# EAGLE design pm2013 (EAGLE 6.0)
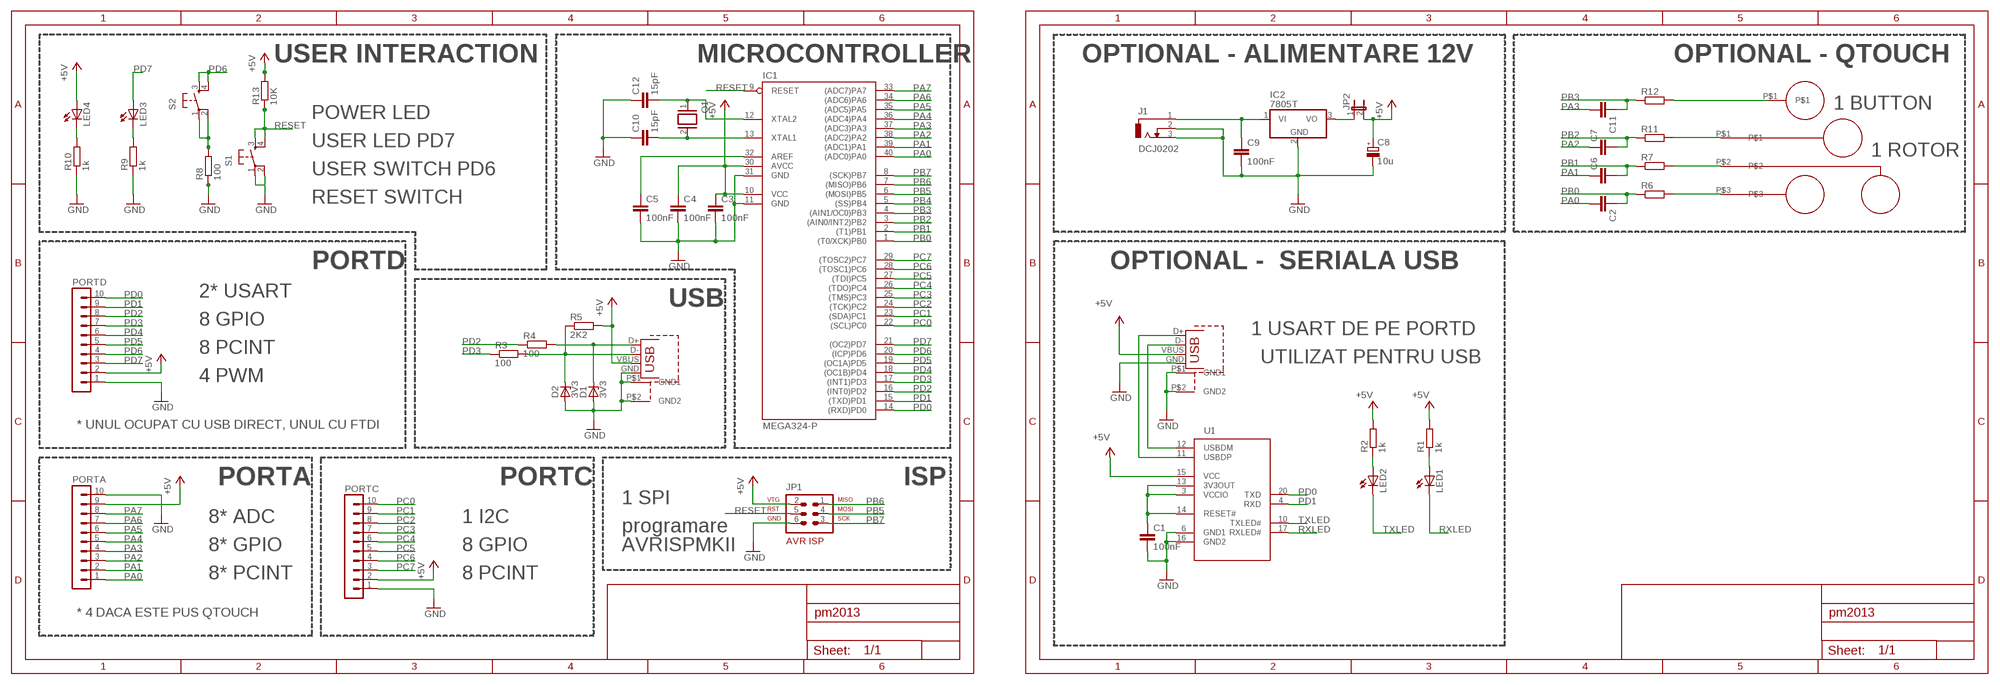
[diagram p0: schematic, sheet 1]

## Parts
C1  100nF  C-EU025-025X050  [C025-025X050]
C2  C-EUC1206  [C1206]
C3  100nF  C-EU025-025X050  [C025-025X050]
C4  100nF  C-EU025-025X050  [C025-025X050]
C5  100nF  C-EU025-025X050  [C025-025X050]
C6  C-EUC1206  [C1206]
C7  C-EUC1206  [C1206]
C8  10u  CPOL-EUE2.5-5  [E2,5-5]
C9  100nF  C-EU025-025X050  [C025-025X050]
C10  15pF  C-EU025-025X050  [C025-025X050]
C11  C-EUC1206  [C1206]
C12  15pF  C-EU025-025X050  [C025-025X050]
D1  3V3  ZENER-DIODEDO34-7  [DO34Z7]
D2  3V3  ZENER-DIODEDO34-7  [DO34Z7]
IC1  MEGA324-P  MEGA16-P  [DIL40]
IC2  7805T  [TO220H]
J1  DCJ0202  [DCJ0202]
JP1  AVR-ISP-6  [AVR-ISP-6]
JP2  JP1E  [JP1]
LED1  TLLR4400  [LED3MM]
LED2  TLLR4400  [LED3MM]
LED3  TLLR4400  [LED3MM]
LED4  TLLR4400  [LED3MM]
PORTA  MA10-1W  [MA10-1W]
PORTC  MA10-1W  [MA10-1W]
PORTD  MA10-1W  [MA10-1W]
Q1  XTAL/S  [QS]
R1  1k  R-EU_0204/7  [0204/7]
R2  1k  R-EU_0204/7  [0204/7]
R3  100  R-EU_0204/7  [0204/7]
R4  100  R-EU_0204/7  [0204/7]
R5  2K2  R-EU_0204/7  [0204/7]
R6  R-EU_M1206  [M1206]
R7  R-EU_M1206  [M1206]
R8  100  R-EU_0204/7  [0204/7]
R9  1k  R-EU_0204/7  [0204/7]
R10  1k  R-EU_0204/7  [0204/7]
R11  R-EU_M1206  [M1206]
R12  R-EU_M1206  [M1206]
R13  10K  R-EU_0204/7  [0204/7]
S1  TAC_SWITCHPTH  [TACTILE-PTH]
S2  TAC_SWITCHPTH  [TACTILE-PTH]
U1  FT231XS  [SSOP20]
U$1  ROTOR_ELECTRODE_TOUCH  [ROTOR_ELECTRODE_TOUCH]
U$2  SIMPLE_ELECTRODE_TOUCH  [SIMPLE_ELECTRODE_TOUCH]
X1  USB  [USB-B-PTH]
X2  USBPTH  USB  [USB-B-PTH]

## Nets
+5V: C3.1 C4.1 C8.+ IC1.10(VCC) IC1.30(AVCC) JP1.2 JP2.2 LED4.A PORTA.9 PORTC.2 PORTD.2 R1.2 R2.2 R5.2 R13.2 U1.15(VCC) X1.VBUS X2.VBUS
GND: C1.2 C3.2 C4.2 C5.2 C8.- C9.2 C10.1 C12.1 D1.A D2.A IC1.11(GND) IC1.31(GND) IC2.2(GND) J1.2 J1.3 JP1.6 PORTA.10 PORTC.1 PORTD.1 R8.1 R9.1 R10.1 S1.1 S1.2 U1.6(GND1) U1.16(GND2) X1.GND X1.P$1(GND1) X1.P$2(GND2) X2.GND X2.P$1(GND1) X2.P$2(GND2)
N$1: LED2.A R2.1
N$2: LED1.A R1.1
N$3: R11.2 U$1.P$1
N$4: R7.2 U$1.P$2
N$5: C1.1 U1.3(VCCIO) U1.13(3V3OUT) U1.14(RESET#)
N$7: R6.2 U$1.P$3
N$14: D1.C R4.2 X2.D+
N$15: D2.C R3.2 R5.1 X2.D-
N$16: C9.1 IC2.1(VI) J1.1
N$17: R8.2 S2.1 S2.2
N$18: IC2.3(VO) JP2.1
N$19: R12.2 U$2.P$1
N$20: C5.1 IC1.32(AREF)
N$21: C10.2 IC1.13(XTAL1) Q1.2
N$22: C12.2 IC1.12(XTAL2) Q1.1
N$24: LED3.K(C) R9.2
N$25: LED4.K(C) R10.2
PA0: C2.2 IC1.40((ADC0)PA0) PORTA.1
PA1: C6.1 IC1.39((ADC1)PA1) PORTA.2
PA2: C7.1 IC1.38((ADC2)PA2) PORTA.3
PA3: C11.2 IC1.37((ADC3)PA3) PORTA.4
PA4: IC1.36((ADC4)PA4) PORTA.5
PA5: IC1.35((ADC5)PA5) PORTA.6
PA6: IC1.34((ADC6)PA6) PORTA.7
PA7: IC1.33((ADC7)PA7) PORTA.8
PB0: C2.1 IC1.1((T0/XCK)PB0) R6.1
PB1: C6.2 IC1.2((T1)PB1) R7.1
PB2: C7.2 IC1.3((AIN0/INT2)PB2) R11.1
PB3: C11.1 IC1.4((AIN1/OC0)PB3) R12.1
PB4: IC1.5((SS)PB4)
PB5: IC1.6((MOSI)PB5) JP1.4
PB6: IC1.7((MISO)PB6) JP1.1
PB7: IC1.8((SCK)PB7) JP1.3
PC0: IC1.22((SCL)PC0) PORTC.10
PC1: IC1.23((SDA)PC1) PORTC.9
PC2: IC1.24((TCK)PC2) PORTC.8
PC3: IC1.25((TMS)PC3) PORTC.7
PC4: IC1.26((TDO)PC4) PORTC.6
PC5: IC1.27((TDI)PC5) PORTC.5
PC6: IC1.28((TOSC1)PC6) PORTC.4
PC7: IC1.29((TOSC2)PC7) PORTC.3
PD0: IC1.14((RXD)PD0) PORTD.10 U1.20(TXD)
PD1: IC1.15((TXD)PD1) PORTD.9 U1.4(RXD)
PD2: IC1.16((INT0)PD2) PORTD.8 R4.1
PD3: IC1.17((INT1)PD3) PORTD.7 R3.1
PD4: IC1.18((OC1B)PD4) PORTD.6
PD5: IC1.19((OC1A)PD5) PORTD.5
PD6: IC1.20((ICP)PD6) PORTD.4 S2.3 S2.4
PD7: IC1.21((OC2)PD7) LED3.A PORTD.3
RESET: IC1.9(RESET) JP1.5 R13.1 S1.3 S1.4
RXLED: LED1.K(C) U1.17(RXLED#)
TXLED: LED2.K(C) U1.10(TXLED#)
USB_D+: U1.11(USBDP) X1.D+
USB_D-: U1.12(USBDM) X1.D-

## Notes on the sheet
- USER INTERACTION | MICROCONTROLLER | OPTIONAL - ALIMENTARE 12V | OPTIONAL - QTOUCH
- 1 BUTTON
- POWER LED
- USER LED PD7
- 1 ROTOR
- USER SWITCH PD6
- RESET SWITCH
- PORTD | OPTIONAL -  SERIALA USB
- 2* USART
- USB
- 8 GPIO
- 1 USART DE PE PORTD
- 8 PCINT
- UTILIZAT PENTRU USB
- 4 PWM
- * UNUL OCUPAT CU USB DIRECT, UNUL CU FTDI
- PORTA | PORTC | ISP
- 1 SPI
- 8* ADC | 1 I2C
- programare
- 8* GPIO | 8 GPIO | AVRISPMKII
- 8* PCINT | 8 PCINT
- * 4 DACA ESTE PUS QTOUCH

## Library data of the parts
C1-C7 C9-C12 = resistor:C-EU: CAPACITOR, European symbol
C8 = resistor:CPOL-EU: POLARIZED CAPACITOR, European symbol
D1 D2 = diode:ZENER-DIODE: Z-Diode
IC1 = atmel:MEGA16-P: MICROCONTROLLER 16 Kbytes FLASH 1 kbytes SRAM 512 bytes EEPROM USART 8-channel 10 bit ADC Source: avr.lbr; MPN: ATMEGA16-16PU; OC_FARNELL: 9171142; OC_NEWARK: 01M6885
IC2 = linear:78*: Positive VOLTAGE REGULATOR Source: http://cache.national.com/ds/LM/LM78L05.pdf http://www.fairchildsemi.com/ds/LM/LM7805.pdf
J1 = 0andrei_custom:DCJ0202: DC POWER JACK Source: DCJ0202.pdf; OC_FARNELL: unknown; OC_NEWARK: unknown
JP1 = atmel-1:AVR-ISP-6: AVR ISP-6 Serial Programming Header
JP2 = jumper:JP1E: JUMPER
LED1-LED4 = led:TLLR4400: Low Current (2mA) LED 3 mm Tinted Diffused Package color RED Source: Data sheet <http://www.farnell.com/datasheets/391100.pdf>; MF: VISHAY SEMICONDUCTOR; OC_FARNELL: 1612437
PORTA PORTC PORTD = con-lstb:MA10-1W: PIN HEADER; OC_FARNELL: unknown; OC_NEWARK: unknown
Q1 = special:XTAL/S: CRYSTAL
R1-R5 R8 R13 = 0andrei_custom:R-EU_: RESISTOR, European symbol
R6 R7 R9-R12 = resistor:R-EU_: RESISTOR, European symbol
S1 S2 = SparkFun:TAC_SWITCH: Momentary Switch Button commonly used for reset or general input. Spark Fun Electronics SKU : COM-00097
U1 = 0andrei_custom:FT231XS
U$1 = 0andrei_custom:ROTOR_ELECTRODE_TOUCH
U$2 = 0andrei_custom:SIMPLE_ELECTRODE_TOUCH
X1 X2 = 0andrei_custom:USB: USB Connectors USB-B-PTH is fully proven SKU : PType-USB-B USB-miniB is fully proven SKU : PType-USB-miniB USB-A-H is throughly reviewed, but untested. Spark Fun Electronics SKU : PType-USB-A USB-B-SMT is throughly reviewed, but untested. Needs silkscreen touching up. USB-A-S has not been used/tested USB-MB-H has not been used/tested

## Net classes
1 power: width 0.61 mm

## Board
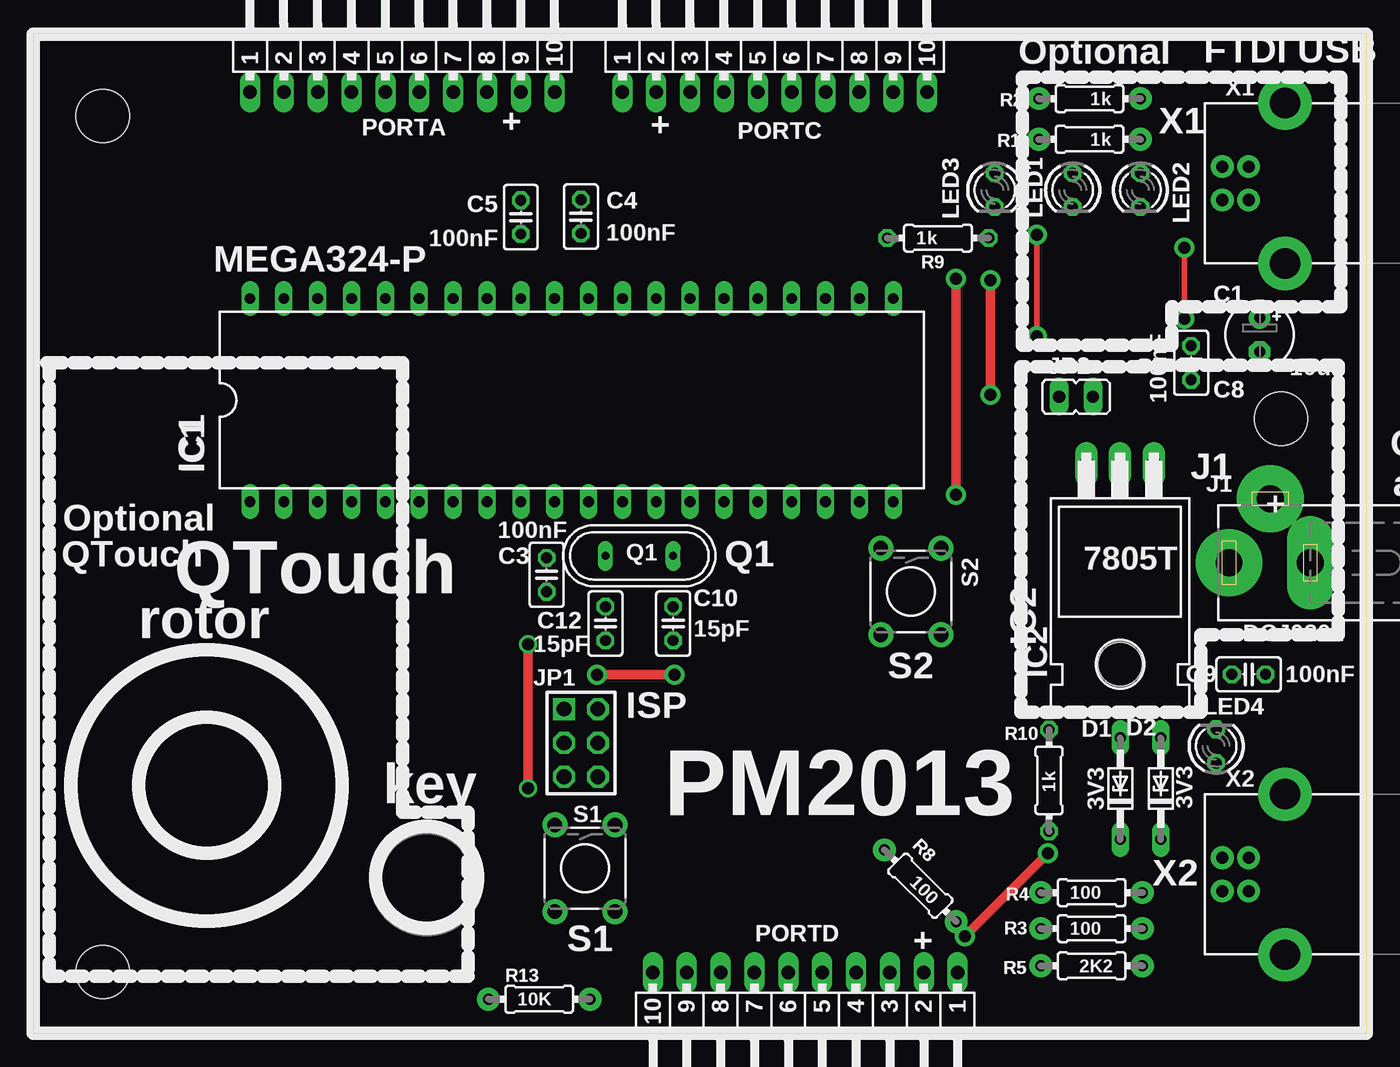
[diagram p1: board, top side]
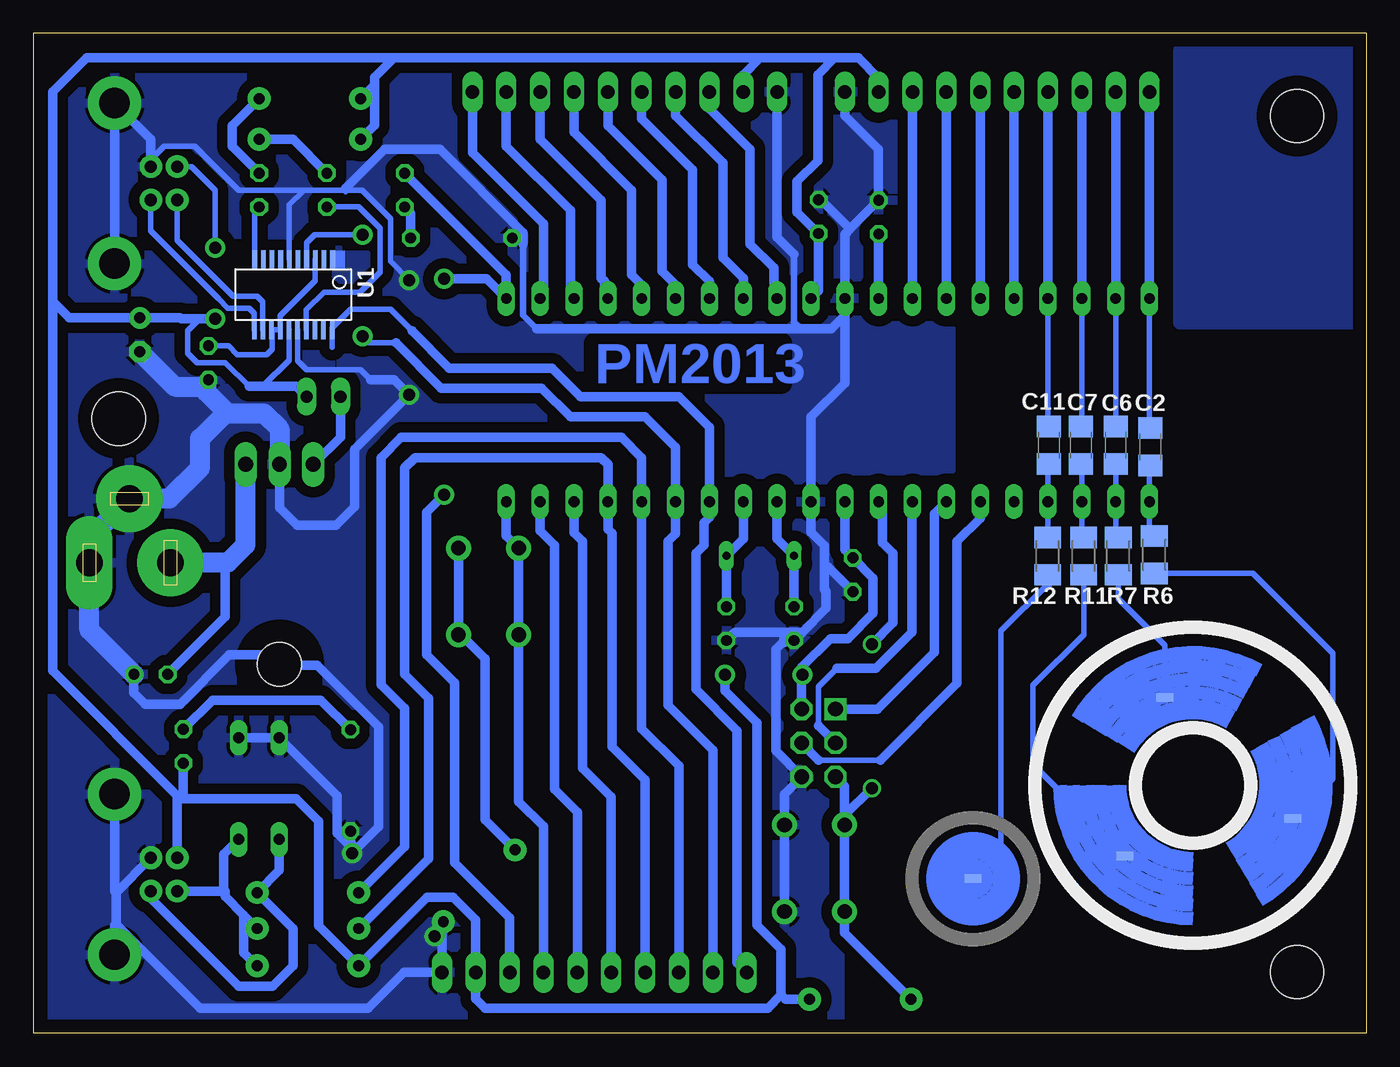
[diagram p2: board, bottom side, seen from below]

Size 100 x 75 mm. Coordinates in mm from the lower left corner, seen from the top.
Outline: 0,0 100,0 100,75 0,75 0,0
Copper layers (1*16): Top 0.035mm / dielectric 1.5mm / Bottom 0.035mm
Design rules: minimum track width 10mil, minimum drill 24mil, track to track 0.01778125mm, track to pad 10mil, pad to pad 10mil, via to via 10mil, smd to smd 0mil, copper to edge 40mil, drill to drill 10mil, minimum pad ring 10mil, minimum via ring 8mil, stop-mask expansion 0mil, vias tented up to drill 0mil, thermal gap 10mil
Holes 4 mm at 93.6,46.1 5.2,4.6 5.2,68.8

### Footprints (pad centres in the part's own frame; a part is rotated, then mirrored left to right if it is on the bottom)
C025-025X050 = drill 0.813 octagon: 1 -1.27,0; 2 1.27,0
C1206 = smd 1.6 x 1.8: 1 -1.4,0; 2 1.4,0
E2,5-5 = drill 0.813 pad 1.6: + -1.27,0 | drill 0.813 pad 1.6 octagon: - 1.27,0
DO34Z7 = drill 0.813 long: A 3.81,0; C -3.81,0
DIL40 = drill 0.813 long: 1 -24.13,-7.62; 2 -21.59,-7.62; 3 -19.05,-7.62; 4 -16.51,-7.62; 5 -13.97,-7.62; 6 -11.43,-7.62; 7 -8.89,-7.62; 8 -6.35,-7.62; 9 -3.81,-7.62; 10 -1.27,-7.62; 11 1.27,-7.62; 12 3.81,-7.62; 13 6.35,-7.62; 14 8.89,-7.62; 15 11.43,-7.62; 16 13.97,-7.62; 17 16.51,-7.62; 18 19.05,-7.62; 19 21.59,-7.62; 20 24.13,-7.62; 21 24.13,7.62; 22 21.59,7.62; 23 19.05,7.62; 24 16.51,7.62; 25 13.97,7.62; 26 11.43,7.62; 27 8.89,7.62; 28 6.35,7.62; 29 3.81,7.62; 30 1.27,7.62; 31 -1.27,7.62; 32 -3.81,7.62; 33 -6.35,7.62; 34 -8.89,7.62; 35 -11.43,7.62; 36 -13.97,7.62; 37 -16.51,7.62; 38 -19.05,7.62; 39 -21.59,7.62; 40 -24.13,7.62
TO220H = drill 1.118 long: 1 -2.54,-10.16; 2 0,-10.16; 3 2.54,-10.16 | hole 3.302: 0,4.826
DCJ0202 = drill 2 pad 5: 1 0,3.1; 2 4.8,0 | drill 2 pad 3.5 long: 3 0,-3
AVR-ISP-6 = drill 1.1 square: 1 -2.54,-1.27 | drill 1.1 octagon: 2 -2.54,1.27; 3 0,-1.27; 4 0,1.27; 5 2.54,-1.27; 6 2.54,1.27
JP1 = drill 0.914 long: 1 0,-1.27; 2 0,1.27
LED3MM = drill 0.813 octagon: A -1.27,0; K 1.27,0
MA10-1W = drill 1.016 long: 1 -11.43,0; 2 -8.89,0; 3 -6.35,0; 4 -3.81,0; 5 -1.27,0; 6 1.27,0; 7 3.81,0; 8 6.35,0; 9 8.89,0; 10 11.43,0
QS = drill 0.61 long: 1 -2.54,0; 2 2.54,0
0204/7 = drill 0.813 pad 1.7: 1 -3.81,0; 2 3.81,0
M1206 = smd 1.6 x 2: 1 -1.4,0; 2 1.4,0
0204/7' = drill 0.813 octagon: 1 -3.81,0; 2 3.81,0
TACTILE-PTH = drill 1.1 pad 1.88: 1 -3.251,2.261; 2 3.251,2.261; 3 -3.251,-2.261; 4 3.251,-2.261
SSOP20 = smd 0.348 x 1.397: 1 -2.955,-2.64; 2 -2.305,-2.64; 3 -1.655,-2.64; 4 -1.005,-2.64; 5 -0.355,-2.64; 6 0.295,-2.64; 7 0.945,-2.64; 8 1.595,-2.64; 9 2.245,-2.64; 10 2.895,-2.64; 11 2.925,2.64; 12 2.275,2.64; 13 1.625,2.64; 14 0.975,2.64; 15 0.325,2.64; 16 -0.325,2.64; 17 -0.975,2.64; 18 -1.625,2.64; 19 -2.275,2.64; 20 -2.925,2.64
ROTOR_ELECTRODE_TOUCH = smd 1.27 x 0.635: P$1 5.1,5.3; P$2 2.1,-6.6; P$3 -7.5,2.5
SIMPLE_ELECTRODE_TOUCH = smd 1.27 x 0.635: P$1 0,0
USB-B-PTH = drill 0.914 pad 1.7: D+ 0,1.25; D- 1.981,1.25; GND 0,-1.25; VBUS 1.981,-1.25 | drill 2.286 pad 4: P$1 -2.718,-6.02; P$2 -2.718,6.02

### Placement (x,y rotation side)
C1  86.87,50.29 270 top
C2  16.2,44 90 bottom
C3  38.51,34.39 270 top
C4  41.09,61.25 90 top
C5  36.58,61.21 90 top
C6  18.8,44.1 270 bottom
C7  21.4,44.1 270 bottom
C8  92.01,52.39 270 top
C9  91.19,26.92 0 top
C10  48.01,30.73 90 top
C11  23.8,44.1 90 bottom
C12  42.93,30.73 90 top
D1  81.55,18.36 90 top
D2  84.59,18.36 90 top
IC1  40.39,47.5 0 top
IC2  81.53,32.51 180 top
J1  92.8,35.3 90 top
JP1  41.09,21.78 270 top
JP2  78.23,47.75 270 top
LED1  77.98,63.25 270 top
LED2  83.06,63.25 270 top
LED3  72.14,63.25 270 top
LED4  88.75,21.54 90 top
PORTA  27.69,70.61 0 top
PORTC  55.63,70.61 0 top
PORTD  57.91,4.57 180 top
Q1  45.47,35.81 0 top
R1  79.25,67.06 180 top
R2  79.25,70.1 180 top
R3  79.4,7.86 0 top
R4  79.4,10.55 0 top
R5  79.4,5.06 180 top
R6  15.9,35.9 270 bottom
R7  18.6,35.8 270 bottom
R8  66.55,11.07 135 top
R9  1k  [0204/7']  67.87,59.64 0 top
R10  1k  [0204/7']  76.21,18.96 90 top
R11  21.2,35.8 270 bottom
R12  23.9,35.8 270 bottom
R13  37.96,2.56 0 top
S1  41.39,12.38 270 top
S2  65.84,33.14 270 top
U1  80.5,55.4 180 bottom
U$1  13,18.6 180 bottom
U$2  29.5,11.6 0 bottom
X1  91.19,63.75 180 top
X2  91.19,11.91 180 top

### Tracks (layer width: path | path; a pad name or v marks a point on that pad's centre or on a via)
+5V  (via drill 0.9 pad 1.5)
  Top 0.4: v86.36,58.93 v86.36,53.59
  Top 0.7: v48.1,26.9 v42.3,26.9
  Bottom 0.4: X1.VBUS 88.12,65 86.36,63.25 v86.36,58.93 | 83.82,48.51 85.61,50.3 87.7,50.3 88.4,51 88.4,52.7 87.51,53.59 | 88.97,53.66 88.9,53.59 | 82.8,48.51 80.83,50.49 U1.15
  Bottom 0.7: PORTA.9 36.58,71.63 38.1,73.15 39.88,73.15 | 98.55,54.9 98.55,70.61 96.01,73.15 73,73.15 | 98.55,54.9 98.55,27.18 89.2,17.83 | 39.88,73.15 41.15,71.88 41.15,65.45 42.7,63.9 42.7,61.6 C4.1 41.09,55.69 IC1.30 | PORTC.2 46.74,71.88 45.47,73.15 | 39.88,73.15 45.47,73.15 | 45.47,73.15 73,73.15 | JP2.2 80.26,48.51 82.8,48.51 83.82,48.51 | 88.7,17.6 80.3,17.6 78.6,15.9 78.6,8.07 R5.2 70.46,10.2 68.5,10.2 66.8,8.5 PORTD.2 66.8,2.6 66.1,1.9 44.9,1.9 43.9,2.9 | 88.7,17.6 88.97,17.6 89.2,17.83 | LED4.A 88.75,17.65 88.7,17.6 | X2.VBUS 89.2,17.83 | 74.4,71.14 74.4,68.09 R1.2 | 74.4,71.14 74.4,71.7 73,73.1 73,73.15 | IC1.10 39.12,36.27 C3.1 37,34.15 37,31.5 38.9,29.6 40.2,29.6 42.36,27.44 42.36,26.3 | JP1.2 42.36,26.3 | 43.9,2.9 43.9,6.3 45.7,8.1 45.7,23.3 48.1,25.7 v48.1,26.9 | v42.3,26.9 42.3,26.36 42.36,26.3 | 88.97,53.66 C8.+ 97.31,53.66 98.55,54.9 | v86.36,53.59 87.51,53.59 88.9,53.59 | R2.2 74.4,71.14 | 43.9,2.9 43.56,2.56 R13.2
GND  (via drill 0.9 pad 1.5)
  Top 0.7: v76.1,13.5 v69.9,7.3 | v71.8,47.9 v71.8,56.5
  Bottom 0.4: 79.7,63.25 84.58,63.25 87.88,66.55 90.17,66.55 91.19,65.53 X1.GND 91.17,65 | 79.7,63.25 76.9,63.25 76.71,63.25 76.58,63.12 76.58,63.37 | 74.68,49.02 75.44,49.78 79.5,49.78 80.17,50.46 U1.16 | U1.6 80.8,62.15 79.7,63.25 | C1.2 87,48.89
  Bottom 0.406: 76.9,63.25 75.35,63.25 73.2,61.1 73.2,57.9 v71.8,56.5
  Bottom 0.5: 62.23,52.83 63.25,53.85 63.25,59.18 | 42.93,58.42 42.93,53.34 42.42,52.83
  Bottom 0.7: 39.12,53.85 39.12,48.77 41.66,46.23 IC1.11 41.66,37.59 40.64,36.58 40.64,35 | 39.12,53.85 IC1.31 39.12,59.94 38.73,60.33 | 38.73,60.33 C5.2 36.58,66.29 39.12,68.83 PORTA.10 | 39.12,53.85 40.13,52.83 42.42,52.83 62.23,52.83 | 91.21,13.18 X2.GND 93.8,10.55 | 42.93,58.42 44.2,59.69 PORTC.1 | 40.64,35 40.64,33.27 40.51,33.15 40.51,31.88 42.29,30.1 | C12.1 42.29,30.1 | C10.1 47.37,30.1 43.7,30.1 | 43.7,30.1 42.29,30.1 | 69.34,6.74 PORTD.1 72.2,4.57 74.87,1.9 87.5,1.9 93.8,8.2 | 75.75,13.85 74.1,15.5 74.1,23 78.7,27.6 80,27.6 80.8,28.4 85.3,28.4 89,24.7 91.6,24.7 92.46,25.56 C9.2 | 75.75,13.85 v76.1,13.5 | R10.1 76.21,14.31 | 76.21,14.31 75.75,13.85 | 76.21,14.31 76.51,14.31 77.2,15 77.2,17.82 D1.A D2.A | 93.8,8.2 93.8,10.55 | v69.9,7.3 69.34,6.74 | 69.34,6.74 69.34,8.27 R8.1 | IC2.2 81.53,39.43 80.2,38.1 77.3,38.1 75.9,39.5 75.9,43.8 v71.8,47.9 72.92,49.02 74.68,49.02 | C3.2 40.39,35 40.64,35 | 43.7,30.1 43.7,29.3 43.8,29.3 44.3,28.8 44.3,21.18 JP1.6 43.65,17.95 S1.1 S1.2 | 87,48.89 87,48.5 87,48.1 | C4.2 40.92,62.52 38.73,60.33 | 76.58,63.37 73.65,66.3 69.5,66.3 63.25,60.05 63.25,59.6 | 63.25,59.18 63.25,59.6 | R9.1 64.02,59.6 63.25,59.6 | X1.GND 91.19,67.06 X1.P$1 X1.P$2 | 93.8,8.2 93.9,8.1 X2.P$2 | X2.P$1 93.9,10.65 93.8,10.55
  Bottom 1.5: IC2.2 81.53,45.33 82.68,46.48 85.38,46.48 85.5,46.6 | C8.- 89.39,48.5 87,48.5 | C9.2 95.8,30.27 J1.3 95.8,37.1 J1.2 89.8,40.1 87.5,42.4 87.5,44.6 85.5,46.6 | 85.5,46.6 87,48.1
  pour Bottom (isolate 0.8): 31.3,74.1 98.9,73.8 98.9,0.7 39.5,0.7 39.5,42.2 31.2,42.2 31.2,58
N$1
  Bottom 0.7: R2.1 85.09,68.07 85.09,66.55 LED2.A
N$2
  Bottom 0.7: R1.1 80.52,67.06 LED1.A
N$3
  Bottom 0.4: U$1.P$1 25,20.2 25,26.1 21.2,29.9 R11.2
N$4
  Bottom 0.4: U$1.P$2 15.1,29.1 18.6,32.6 R7.2
N$5
  Bottom 0.4: U1.14 U1.13 82.1,52.73 | 79.2,56.1 78.84,56.45 U1.3
  Bottom 0.406: 82.1,52.73 82.1,51.3 82.5,50.9 84.7,50.9 85.36,51.56 C1.1 | 79.2,56.1 81.47,53.83 U1.14
N$6
  pour Bottom (isolate 0.8): 14,73.7 0.8,73.7 0.8,53.3 14,53.3
N$7
  Bottom 0.4: U$1.P$3 2.5,19.1 2.5,28.5 8.5,34.5 R6.2
N$8
  pour Bottom: 77.4,58.9 77.4,56.8 77,56.4 76.1,56.4 74.9,57.6 74.9,58.5 76.6,58.5 77,58.9
N$14
  Bottom 0.7: D1.C 81.55,12.21 R4.2 80.52,7.86 80.52,5.06 82.04,3.53 84.58,3.53 91.19,10.14 X2.D+
N$15
  Bottom 0.7: X2.D- 85.7,10.66 | 85.7,10.66 85.62,10.66 85.62,10.26 84.2,8.85 | D2.C 85.7,13.44 85.7,10.66 | R5.1 84.2,6.05 84.2,8.85 | 84.2,8.85 R3.2
N$16
  Bottom 0.7: C9.1 85.6,31.24 85.6,35.3
  Bottom 1.5: IC2.1 84.07,36.63 85.4,35.3 85.6,35.3 J1.1
N$17
  Bottom 0.7: S2.1 S2.2 67.89,29.89 66.1,28.1 66.1,16.01 R8.2
N$18
  Bottom 0.7: IC2.3 76.96,44.7 JP2.1
N$19
  Bottom 0.4: U$2.P$1 27.4,13.7 27.4,30.2 23.9,33.7
  Bottom 0.7: 23.9,33.7 R12.2
N$20
  Bottom 0.7: IC1.32 C5.1
N$21
  Bottom 0.7: IC1.13 46.74,37.08 Q1.2 C10.2
N$22
  Bottom 0.7: IC1.12 44.2,37.08 Q1.1 C12.2
N$24
  Bottom 0.7: LED3.K 71.68,61.52 R9.2
N$25
  Bottom 0.7: R10.2 78.43,25 86.55,25 LED4.K
PA0
  Bottom 0.4: IC1.40 16.26,45.46 C2.2
  Bottom 0.7: IC1.40 PORTA.1
PA1
  Bottom 0.4: IC1.39 C6.1
  Bottom 0.7: IC1.39 PORTA.2
PA2
  Bottom 0.4: IC1.38 21.34,45.56 C7.1
  Bottom 0.7: IC1.38 PORTA.3
PA3
  Bottom 0.4: IC1.37 23.88,45.58 C11.2
  Bottom 0.7: IC1.37 PORTA.4
PA4
  Bottom 0.7: IC1.36 PORTA.5
PA5
  Bottom 0.7: IC1.35 PORTA.6
PA6
  Bottom 0.7: IC1.34 PORTA.7
PA7
  Bottom 0.7: IC1.33 PORTA.8
PB0
  Bottom 0.4: R6.1 16.26,37.66 IC1.1 16.26,42.54 C2.1
PB1
  Bottom 0.4: R7.1 18.8,37.4 IC1.2 C6.2
PB2
  Bottom 0.4: R11.1 21.34,37.34 IC1.3 21.34,42.64 C7.2
PB3
  Bottom 0.4: R12.1 23.88,37.22 IC1.4 23.88,42.62 C11.1
PB5
  Bottom 0.4: 41.08,20.5 36.44,20.5
  Bottom 0.7: JP1.4 41.08,20.5 | IC1.6 28.96,38.64 30.7,36.9 30.7,26.24 36.44,20.5
PB6
  Bottom 0.7: JP1.1 36.68,24.32 32.4,28.6 32.4,38.97 IC1.7
PB7
  Bottom 0.4: 41.1,23.06 41.1,26 39.7,27.4
  Bottom 0.7: IC1.8 34.1,39.81 34.1,30.1 36.8,27.4 39.7,27.4 | JP1.3 41.1,23.06
PC0
  Bottom 0.7: IC1.22 61.72,55.37 61.72,60.71 67.06,66.04 PORTC.10
PC1
  Bottom 0.7: IC1.23 59.69,55.37 59.69,61.72 64.52,66.55 PORTC.9
PC2
  Bottom 0.7: IC1.24 57.15,55.37 57.15,56.39 57.4,56.64 57.4,62.48 61.98,67.06 PORTC.8
PC3
  Bottom 0.7: IC1.25 54.36,56.13 55.12,56.9 55.12,63.25 59.44,67.56 PORTC.7
PC4
  Bottom 0.7: IC1.26 51.82,56.13 52.83,57.15 52.83,64.01 56.9,68.07 PORTC.6
PC5
  Bottom 0.7: IC1.27 49.28,56.39 50.55,57.66 50.55,64.77 54.36,68.58 PORTC.5
PC6
  Bottom 0.7: IC1.28 46.74,56.64 48.26,58.17 48.26,65.28 51.82,68.83 PORTC.4
PC7
  Bottom 0.7: IC1.29 44.45,55.37 44.45,57.4 46.23,59.18 46.23,66.29 49.28,69.34 PORTC.3
PD0
  Bottom 0.4: 73.2,54.3 71.6,52.7 | 77.58,51.48 U1.20 77.58,52.92 77.5,53
  Bottom 0.406: 77.5,53 76.2,54.3 73.2,54.3
  Bottom 0.7: 71.6,52.7 68.8,49.9 61.08,49.9 58.93,47.75 51.56,47.75 49.28,45.47 IC1.14 49.28,38.72 49.7,38.3 49.7,36.6 50.3,36 50.3,25.8 47.2,22.7 47.2,5.29 PORTD.10
PD1  (via drill 0.9 pad 1.5)
  Top 0.406: v75.3,52.3 v75.3,59.9
  Bottom 0.4: 74,51.8 74.8,51.8 v75.3,52.3 | v75.3,59.9 77,59.9
  Bottom 0.406: 72.8,51.8 74,51.8 | 77,59.9 78.9,59.9 79.5,59.3 U1.4
  Bottom 0.7: PORTD.9 49.02,21.22 52.4,24.6 52.4,36.9 51.82,37.48 IC1.15 51.82,43.94 54.1,46.23 59.69,46.23 61.86,48.4 69.4,48.4 72.8,51.8
PD2
  Bottom 0.7: PORTD.8 51.56,20.06 54.36,22.86 IC1.16 54.36,43.18 55.88,44.7 72.39,44.7 73.91,43.18 73.91,26.16 72.14,24.38 72.14,14.01 R4.1
PD3
  Bottom 0.7: PORTD.7 54.1,19 56.6,21.5 56.6,37.5 56.9,37.8 IC1.17 56.9,42.67 57.4,43.18 71.37,43.18 72.14,42.42 72.14,26.92 70.36,25.15 70.36,13.09 R3.1
PD4
  Bottom 0.7: IC1.18 59.44,37.54 58.8,36.9 58.8,19.9 56.64,17.74 PORTD.6
PD5
  Bottom 0.7: IC1.19 61.98,37.68 60.9,36.6 60.9,18.3 59.18,16.58 PORTD.5
PD6
  Bottom 0.7: PORTD.4 61.72,15.52 63.58,17.38 S2.4 S2.3 64.52,37.33 IC1.20
PD7  (via drill 0.9 pad 1.5)
  Top 0.7: v69.2,40.4 v69.2,56.6
  Bottom 0.7: LED3.A 64.52,56.9 IC1.21 66,56.6 v69.2,56.6 | PORTD.3 64.26,8.66 68.4,12.8 68.4,26.3 70.5,28.4 70.5,39.1 v69.2,40.4
RESET  (via drill 0.9)
  Top 0.7: v37.1,29.2 v37.1,18.4
  Bottom 0.7: R13.1 39.13,7.54 S1.4 S1.3 39.13,16.37 | IC1.9 36.3,39.88 36.3,36.8 35.5,36 35.5,30.8 v37.1,29.2 | v37.1,18.4 39.13,16.37 | JP1.5 39.13,18.55 39.13,16.37
RXLED
  Bottom 0.4: 77,55.6 77.3,55.6 78.2,55.6 79.53,54.27 U1.17
  Bottom 0.406: 77.3,55.6 75.5,55.6 74,57.1 74,60.4 75.58,61.98 LED1.K
TXLED
  Bottom 0.4: 83.39,61.64 U1.10
  Bottom 0.406: LED2.K 83.39,61.64
USB_D+
  Bottom 0.4: 91.19,61.21 X1.D+ | 86.1,55.1 85.4,54.4 83.8,54.4 83.42,54.02 U1.11
  Bottom 0.406: 86.1,55.1 91.19,60.19 91.19,61.21
USB_D-
  Bottom 0.4: 88.65,58.93 85.02,55.3 83.2,55.3 82.78,54.88 U1.12
  Bottom 0.406: 88.65,58.93 89.2,59.49 X1.D-
(copper drawn outside any net)
  shapes: Bottom area x1

### Text on the board
Bottom: PM2013
tPlace: Optional | FTDI USB | Optional | alimentare 12V | Optional | QTouch
tNames: + | + | + | +
_tsilk: 1 | 2 | 3 | 4 | 5 | 6 | 7 | 8 | 9 | 10 | 1 | 2 | 3 | 4 | 5 | 6 | 7 | 8 | 9 | 10 | R2 | 1k | X1 | + | 1k | PORTA | + | PORTC | R1 | LED3 | C5 | C4 | LED1 | LED2 | 100nF | 100nF | 1k | R9 | MEGA324-P | C1 | 100nF | JP2 | 10u | C8 | IC1 | J1 | + | 100nF | 7805T | C3 | Q1 | QTouch | C10 | rotor | C12 | 15pF | 15pF | IC2 | DCJ0202 | S2 | C9 | 100nF | ISP | LED4 | R10 | D1 | D2 | 1k | key | 3V3 | 3V3 | PM2013 | R8 | X2 | 100 | R4 | 100 | PORTD | R3 | 100 | S1 | + | 2K2 | R13 | R5 | 10 | 9 | 8 | 7 | 6 | 5 | 4 | 3 | 2 | 1 | 10K
_bsilk: U1 | FT231XS | C7 | C2 | C6 | C11 | R6 | R7 | R11 | R12